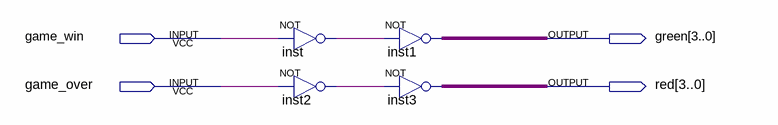
[diagram p0: schematic sheet]
// Quartus schematic color_controller.bdf as structural Verilog: 4 symbols, 4 pins
module color_controller (
  input  game_win,
  input  game_over,
  output [3:0] green,
  output [3:0] red
);

  wire inst2_out, inst_out;

  not inst (inst_out, game_win);
  not inst2 (inst2_out, game_over);
  assign green = ~{4{inst_out}};  // NOT inst1, 4 bits wide
  assign red = ~{4{inst2_out}};  // NOT inst3, 4 bits wide
endmodule
